# Altium schematic sheet MSP430贴片转直插板.SchDoc
size A4
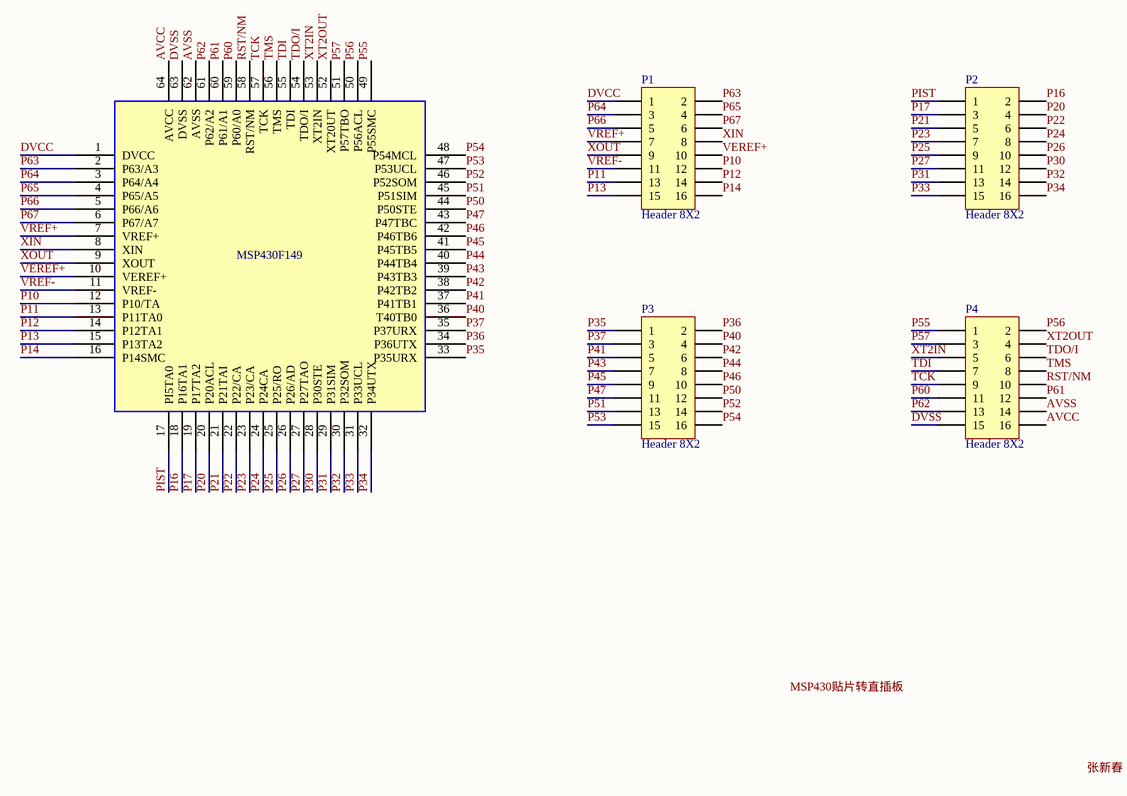
[diagram p0: MSP430贴片转直插板.SchDoc]

## Parts
?  MSP430F149  [MSP41X]
P1  Header 8X2  [HDR2X8]
P2  Header 8X2  [HDR2X8]
P3  Header 8X2  [HDR2X8]
P4  Header 8X2  [HDR2X8]

## Nets
AVCC: ?.64(AVCC) P4.16
AVSS: ?.62(AVSS) P4.14
DVCC: ?.1(DVCC) P1.1
DVSS: ?.63(DVSS) P4.15
P10: ?.12(P10/TA) P1.12
P11: ?.13(P11TA0) P1.13
P12: ?.14(P12TA1) P1.14
P13: ?.15(P13TA2) P1.15
P14: ?.16(P14SMC) P1.16
P16: ?.18(P16TA1) P2.2
P17: ?.19(P17TA2) P2.3
P20: ?.20(P20ACL) P2.4
P21: ?.21(P21TAI) P2.5
P22: ?.22(P22/CA) P2.6
P23: ?.23(P23/CA) P2.7
P24: ?.24(P24CA) P2.8
P25: ?.25(P25/RO) P2.9
P26: ?.26(P26/AD) P2.10
P27: ?.27(P27TAO) P2.11
P30: ?.28(P30STE) P2.12
P31: ?.29(P31SIM) P2.13
P32: ?.30(P32SOM) P2.14
P33: ?.31(P33UCL) P2.15
P34: ?.32(P34UTX) P2.16
P35: ?.33(P35URX) P3.1
P36: ?.34(P36UTX) P3.2
P37: ?.35(P37URX) P3.3
P40: ?.36(T40TB0) P3.4
P41: ?.37(P41TB1) P3.5
P42: ?.38(P42TB2) P3.6
P43: ?.39(P43TB3) P3.7
P44: ?.40(P44TB4) P3.8
P45: ?.41(P45TB5) P3.9
P46: ?.42(P46TB6) P3.10
P47: ?.43(P47TBC) P3.11
P50: ?.44(P50STE) P3.12
P51: ?.45(P51SIM) P3.13
P52: ?.46(P52SOM) P3.14
P53: ?.47(P53UCL) P3.15
P54: ?.48(P54MCL) P3.16
P55: ?.49(P55SMC) P4.1
P56: ?.50(P56ACL) P4.2
P57: ?.51(P57TBO) P4.3
P60: ?.59(P60/A0) P4.11
P61: ?.60(P61/A1) P4.12
P62: ?.61(P62/A2) P4.13
P63: ?.2(P63/A3) P1.2
P64: ?.3(P64/A4) P1.3
P65: ?.4(P65/A5) P1.4
P66: ?.5(P66/A6) P1.5
P67: ?.6(P67/A7) P1.6
PIST: ?.17(PI5TA0) P2.1
RST/NM: ?.58(RST/NM) P4.10
TCK: ?.57(TCK) P4.9
TDI: ?.55(TDI) P4.7
TDO/I: ?.54(TDO/I) P4.6
TMS: ?.56(TMS) P4.8
VEREF+: ?.10(VEREF+) P1.10
VREF+: ?.7(VREF+) P1.7
VREF-: ?.11(VREF-) P1.11
XIN: ?.8(XIN) P1.8
XOUT: ?.9(XOUT) P1.9
XT2IN: ?.53(XT2IN) P4.5
XT2OUT: ?.52(XT20UT) P4.4

## Notes on the sheet
- Labels drawn without touching a wire or pin: MSP430贴片转直插板, 张新春

## Library data of the parts
? = MSP430F133
P1-P4 = Header 8X2: Header, 8-Pin, Dual row; LatestRevisionDate: 17-Jul-2002; LatestRevisionNote: Re-released for DXP Platform.; Publisher: Altium Limited